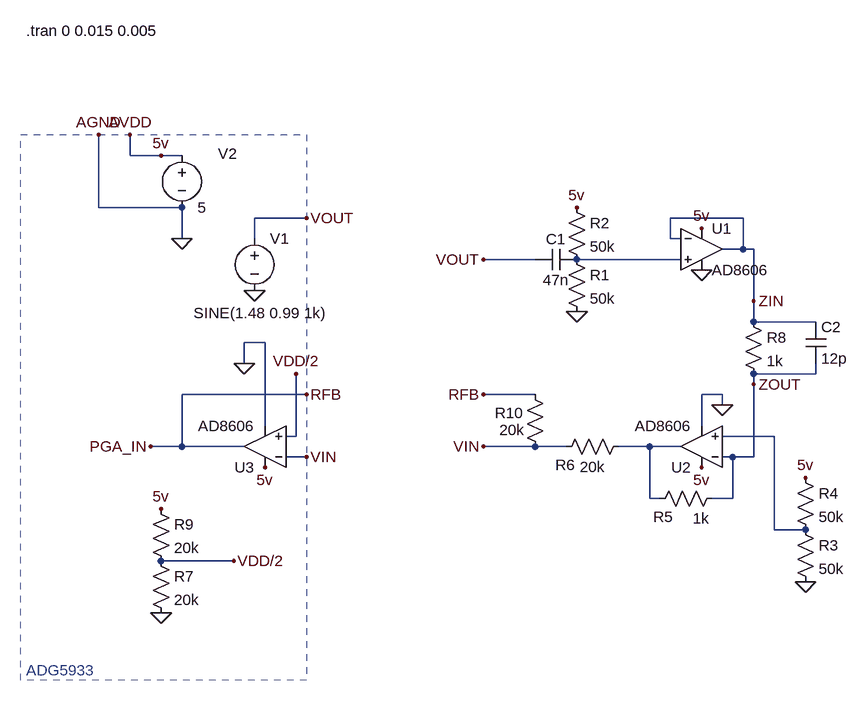
[diagram p0: schematic AD5933_model_RC12.asc]
AD5933_model_RC12.asc, the LTspice schematic file:
Version 4
SHEET 1 880 828
WIRE -352 16 -352 -16
WIRE -304 16 -352 16
WIRE -272 16 -304 16
WIRE -400 96 -400 -16
WIRE -272 96 -400 96
WIRE -80 112 -160 112
WIRE 592 112 480 112
WIRE -272 144 -272 96
WIRE -160 144 -160 112
WIRE 480 144 480 112
WIRE 496 144 480 144
WIRE 592 160 592 112
WIRE 592 160 560 160
WIRE 608 160 592 160
WIRE 272 176 192 176
WIRE 496 176 336 176
WIRE 608 240 608 160
WIRE 608 272 608 240
WIRE 704 272 608 272
WIRE -144 304 -176 304
WIRE -176 336 -176 304
WIRE 704 352 704 336
WIRE 704 352 608 352
WIRE 608 368 608 352
WIRE -80 384 -272 384
WIRE 272 384 192 384
WIRE 560 384 528 384
WIRE 560 400 560 384
WIRE -144 432 -144 304
WIRE 528 432 528 384
WIRE -96 448 -96 352
WIRE -96 448 -112 448
WIRE 640 448 560 448
WIRE -272 464 -272 384
WIRE -272 464 -320 464
WIRE -176 464 -272 464
WIRE 272 464 192 464
WIRE 320 464 272 464
WIRE 448 464 400 464
WIRE 496 464 448 464
WIRE -80 480 -112 480
WIRE 576 480 560 480
WIRE 608 480 608 368
WIRE 608 480 576 480
WIRE 448 544 448 464
WIRE 464 544 448 544
WIRE 576 544 576 480
WIRE 576 544 544 544
WIRE 640 592 640 448
WIRE 688 592 640 592
WIRE -192 640 -304 640
FLAG 336 256 0
FLAG -304 16 5v
FLAG -272 144 0
FLAG -160 224 0
FLAG 336 96 5v
FLAG 528 192 0
FLAG 560 400 0
FLAG 528 128 5v
FLAG 528 496 5v
FLAG 688 672 0
FLAG 688 512 5v
FLAG 192 384 RFB
FLAG 192 464 VIN
FLAG 192 176 VOUT
FLAG 608 240 ZIN
FLAG 608 368 ZOUT
FLAG -80 384 RFB
FLAG -80 480 VIN
FLAG -144 496 5v
FLAG -320 464 PGA_IN
FLAG -304 720 0
FLAG -304 560 5v
FLAG -192 640 VDD/2
FLAG -176 336 0
FLAG -96 352 VDD/2
FLAG -80 112 VOUT
FLAG -352 -16 AVDD
FLAG -400 -16 AGND
SYMBOL Opamps/AD8606 528 96 R0
SYMATTR InstName U1
SYMBOL Opamps/AD8606 528 528 R180
SYMATTR InstName U2
SYMBOL res 320 160 R0
SYMATTR InstName R1
SYMATTR Value 50k
SYMBOL res 320 80 R0
SYMATTR InstName R2
SYMATTR Value 50k
SYMBOL cap 336 160 R90
WINDOW 0 0 32 VBottom 2
WINDOW 3 32 32 VTop 2
SYMATTR InstName C1
SYMATTR Value 47n
SYMBOL voltage -160 128 R0
WINDOW 3 -94 130 Left 2
SYMATTR Value SINE(1.48 0.99 1k)
SYMATTR InstName V1
SYMBOL voltage -272 0 R0
WINDOW 0 56 13 Left 2
SYMATTR InstName V2
SYMATTR Value 5
SYMBOL res 672 576 R0
SYMATTR InstName R3
SYMATTR Value 50k
SYMBOL res 672 496 R0
SYMATTR InstName R4
SYMATTR Value 50k
SYMBOL res 560 528 R90
WINDOW 0 60 91 VBottom 2
WINDOW 3 31 33 VTop 2
SYMATTR InstName R5
SYMATTR Value 1k
SYMBOL res 416 448 R90
WINDOW 0 60 98 VBottom 2
WINDOW 3 32 56 VTop 2
SYMATTR InstName R6
SYMATTR Value 20k
SYMBOL res 592 256 R0
SYMATTR InstName R8
SYMATTR Value 1k
SYMBOL Opamps/AD8606 -144 528 R180
SYMATTR InstName U3
SYMBOL res -320 624 R0
SYMATTR InstName R7
SYMATTR Value 20k
SYMBOL res -320 544 R0
SYMATTR InstName R9
SYMATTR Value 20k
SYMBOL res 288 480 R180
WINDOW 0 34 68 Left 2
WINDOW 3 32 42 Left 2
SYMATTR InstName R10
SYMATTR Value 20k
SYMBOL cap 688 272 R0
SYMATTR InstName C2
SYMATTR Value 12p
TEXT -512 -176 Left 2 !.tran 0 0.015 0.005
TEXT -512 808 Left 2 ;ADG5933
RECTANGLE Normal -520 -16 -80 824 2

The netlist it stands for:
* AD5933_model_RC12.asc
XU1 N001 ZIN AVDD 0 ZIN AD8606  ; pins In+ In- V+ V- OUT
XU2 N002 ZOUT AVDD 0 N003 AD8606  ; pins In+ In- V+ V- OUT
R1 N001 0 50k
R2 AVDD N001 50k
C1 N001 VOUT 47n
V1 VOUT 0 SINE(1.48 0.99 1k)
V2 AVDD 0 5
R3 N002 0 50k
R4 AVDD N002 50k
R5 ZOUT N003 1k
R6 N003 VIN 20k
R8 ZIN ZOUT 1k
XU3 VDD/2 VIN AVDD 0 PGA_IN AD8606  ; pins In+ In- V+ V- OUT
R7 VDD/2 0 20k
R9 AVDD VDD/2 20k
R10 VIN PGA_IN 20k
C2 ZIN ZOUT 12p
.tran 0 0.015 0.005
* ADG5933
.lib ADI.lib
.backanno
.end